# EAGLE schematic ESP32 Relay Mainboard (EAGLE 9.3.0)

## Sheet 1 of 4
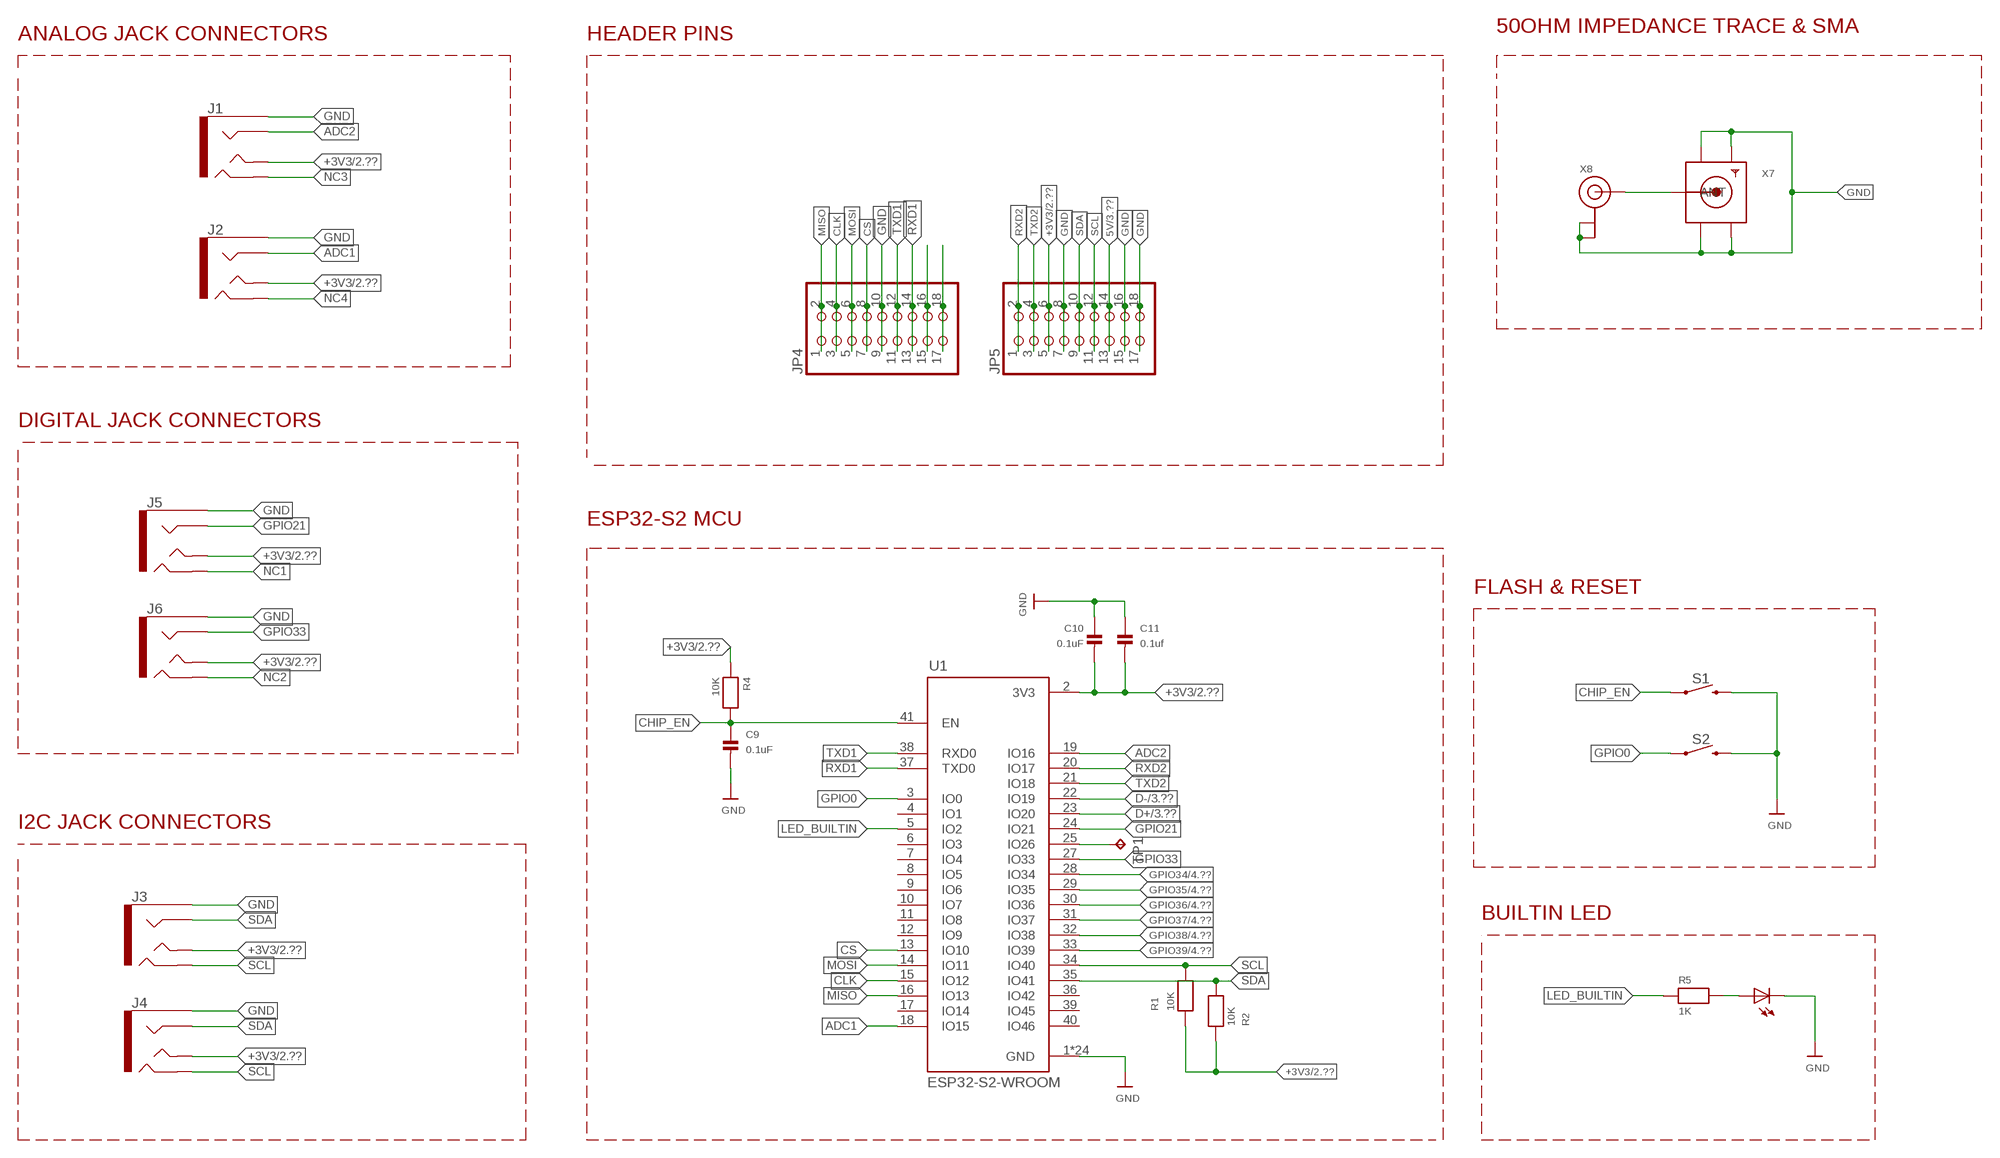
[diagram p0: schematic, sheet 1]

### Parts
C9  0.1uF  CAP_CERAMIC0805  [0805]
C10  0.1uF  CAP_CERAMIC0805  [0805]
C11  0.1uf  CAP_CERAMIC0805  [0805]
J1  AUDIO_JACK_TRRSSMD_RA  [AUDIO_JACK_3.5MM_TRRS_SMD_RA]
J2  AUDIO_JACK_TRRSSMD_RA  [AUDIO_JACK_3.5MM_TRRS_SMD_RA]
J3  AUDIO_JACK_TRRSSMD_RA  [AUDIO_JACK_3.5MM_TRRS_SMD_RA]
J4  AUDIO_JACK_TRRSSMD_RA  [AUDIO_JACK_3.5MM_TRRS_SMD_RA]
J5  AUDIO_JACK_TRRSSMD_RA  [AUDIO_JACK_3.5MM_TRRS_SMD_RA]
J6  AUDIO_JACK_TRRSSMD_RA  [AUDIO_JACK_3.5MM_TRRS_SMD_RA]
JP4  PINHD-2X9-BIG  [2X09-BIG]
JP5  PINHD-2X9-BIG  [2X09-BIG]
LED1  LEDCHIPLED_0805  [CHIPLED_0805]
R1  10K  RESISTOR0805  [0805]
R2  10K  RESISTOR0805  [0805]
R4  10K  RESISTOR0805  [0805]
R5  1K  RESISTOR0805  [0805]
S1  MOMENTARY-SWITCH-SPST-SMD-5.2-REDUNDANT  [TACTILE_SWITCH_SMD_5.2MM]
S2  MOMENTARY-SWITCH-SPST-SMD-5.2-REDUNDANT  [TACTILE_SWITCH_SMD_5.2MM]
TP1  TPTP20R  [TP20R]
U1  ESP32-S2-WROOM  [XCVR_ESP32-S2-WROOM]
X7  SMACONNECTOR_EDGE  [SMA_EDGELAUNCH]
X8  ANTENNA_U.FL  [U.FL]

### Nets
5V: JP5.13 JP5.14 ; also sheet 2,3,4
+3V3: C10.2 C11.2 J1.TIP J2.TIP J3.TIP J4.TIP J5.TIP J6.TIP JP5.5 JP5.6 R1.1 R2.1 R4.1 U1.2(3V3) ; also sheet 2
ADC1: J2.RING1 U1.18(IO15)
ADC2: J1.RING1 U1.19(IO16)
CHIP_EN: C9.1 R4.2 S1.1 S1.2 U1.41(EN)
CLK: JP4.3 JP4.4 U1.15(IO12)
CS: JP4.7 JP4.8 U1.13(IO10)
D+: U1.23(IO20) ; also sheet 3
D-: U1.22(IO19) ; also sheet 3
GND: C9.2 C10.1 C11.1 J1.EARTH J2.EARTH J3.EARTH J4.EARTH J5.EARTH J6.EARTH JP4.9 JP4.10 JP5.7 JP5.8 JP5.15 JP5.16 JP5.17 JP5.18 LED1.C S1.3 S1.4 S2.3 S2.4 U1.1(GND) U1.26(GND) U1.42(GND) U1.43.1(GND) U1.43.2(GND) U1.43.3(GND) U1.43.4(GND) U1.43.5(GND) U1.43.6(GND) U1.43.7(GND) U1.43.8(GND) U1.43.9(GND) U1.43.10(GND) U1.43.11(GND) U1.43.12(GND) U1.43.13(GND) U1.43.14(GND) U1.43.15(GND) U1.43.16(GND) U1.43.17(GND) U1.43.18(GND) U1.43.19(GND) U1.43.20(GND) U1.43.21(GND) X7.GND@1(GND4) X7.GND@2(GND3) X7.GND@3(GND2) X7.GND@4(GND1) X8.1(GND) X8.2(GND) ; also sheet 2,3,4
GPIO0: S2.1 S2.2 U1.3(IO0)
GPIO21: J5.RING1 U1.24(IO21)
GPIO33: J6.RING1 U1.27(IO33)
GPIO34: U1.28(IO34) ; also sheet 4
GPIO35: U1.29(IO35) ; also sheet 4
GPIO36: U1.30(IO36) ; also sheet 4
GPIO37: U1.31(IO37) ; also sheet 4
GPIO38: U1.32(IO38) ; also sheet 4
GPIO39: U1.33(IO39) ; also sheet 4
LED_BUILTIN: R5.1 U1.5(IO2)
MISO: JP4.1 JP4.2 U1.16(IO13)
MOSI: JP4.5 JP4.6 U1.14(IO11)
N$6: LED1.A R5.2
N$8: X7.P(ANT) X8.3(SIGNAL)
N$17: TP1.TP U1.25(IO26)
N$169: JP4.15 JP4.16
N$171: JP4.17 JP4.18
NC1: J5.RING2
NC2: J6.RING2
NC3: J1.RING2
NC4: J2.RING2
RXD1: JP4.13 JP4.14 U1.37(TXD0)
RXD2: JP5.1 JP5.2 U1.20(IO17)
SCL: J3.RING2 J4.RING2 JP5.11 JP5.12 R1.2 U1.34(IO40)
SDA: J3.RING1 J4.RING1 JP5.9 JP5.10 R2.2 U1.35(IO41)
TXD1: JP4.11 JP4.12 U1.38(RXD0)
TXD2: JP5.3 JP5.4 U1.21(IO18)
Unconnected: U1.4(IO1) U1.6(IO3) U1.7(IO4) U1.8(IO5) U1.9(IO6) U1.10(IO7) U1.11(IO8) U1.12(IO9) U1.17(IO14) U1.36(IO42) U1.39(IO45) U1.40(IO46)

### Notes on the sheet
- 50OHM IMPEDANCE TRACE & SMA
- ANALOG JACK CONNECTORS | HEADER PINS
- DIGITAL JACK CONNECTORS
- ESP32-S2 MCU
- FLASH & RESET
- I2C JACK CONNECTORS
- BUILTIN LED

## Sheet 2 of 4
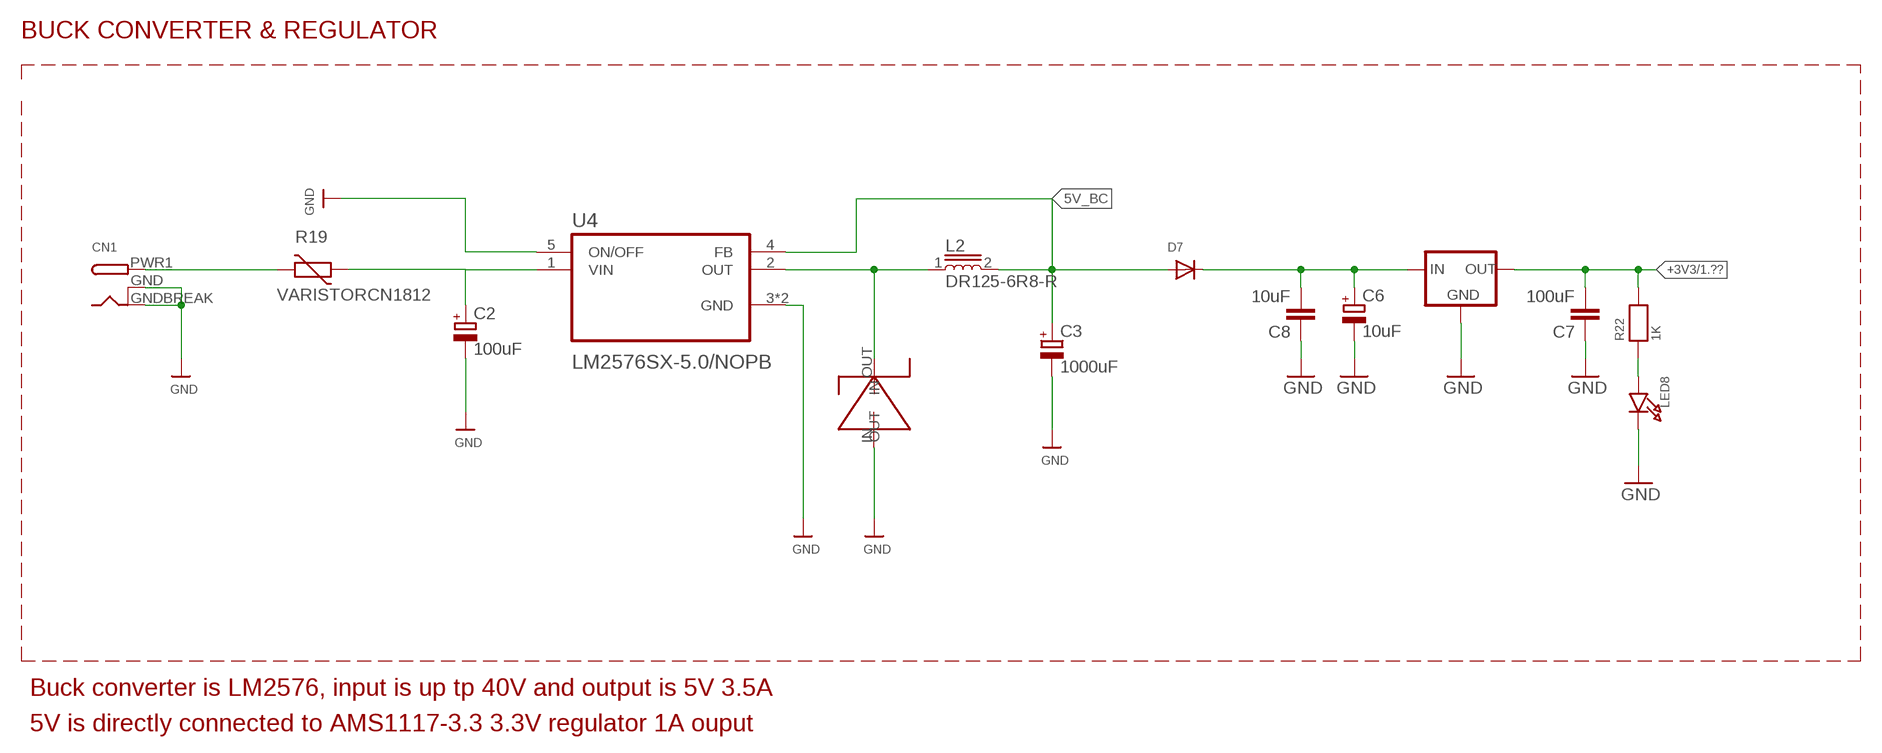
[diagram p1: schematic, sheet 2]

### Parts
3.3V  LM1117  [SOT223]
C2  100uF  CPOL-EUUD-8X10  [UD-8X10_NICHICON]
C3  1000uF  CPOL-EUUD-10X10  [UD-10X10_NICHICON]
C6  10uF  CPOL-EUUD-5X5,8  [UD-5X5,8_NICHICON]
C7  100uF  22UF-0805-6.3V-20%  [0805]
C8  10uF  22UF-0805-6.3V-20%  [0805]
CN1  DCBARRELSMT  [DCJACK_2MM_SMT]
D7  DIODESMA  [SMADIODE]
L2  DR125-6R8-R  [INDM1250X1250X600]
LED8  LED0805  [CHIPLED_0805]
R19  VARISTORCN1812  [CT/CN1812]
R22  1K  RESISTOR0805  [0805]
U4  LM2576SX-5.0/NOPB  [VREG_TPS79625KTTR]
U$8  DO-214AB  [DO-214AB]

### Nets
5V: 3.3V.3(IN) C6.+ C8.2 D7.C ; also sheet 1,3,4
5V_BC: C3.+ D7.A L2.2 U4.4(FB)
+3V3: 3.3V.2(OUT) C7.2 R22.2 ; also sheet 1
GND: 3.3V.1(GND) C2.- C3.- C6.- C7.1 C8.1 CN1.GND(GNDBREAK) CN1.GNDBREAK(GND) LED8.C U4.3(GND) U4.5(ON/OFF) U4.6(GND) U$8.IN ; also sheet 1,3,4
N$1: C2.+ R19.1 U4.1(VIN)
N$5: L2.1 U4.2(OUT) U$8.OUT
N$54: CN1.PWR1(PWR) R19.2
N$71: LED8.A R22.1

### Notes on the sheet
- BUCK CONVERTER & REGULATOR
- Buck converter is LM2576, input is up tp 40V and output is 5V 3.5A
- 5V is directly connected to AMS1117-3.3 3.3V regulator 1A ouput

## Sheet 3 of 4
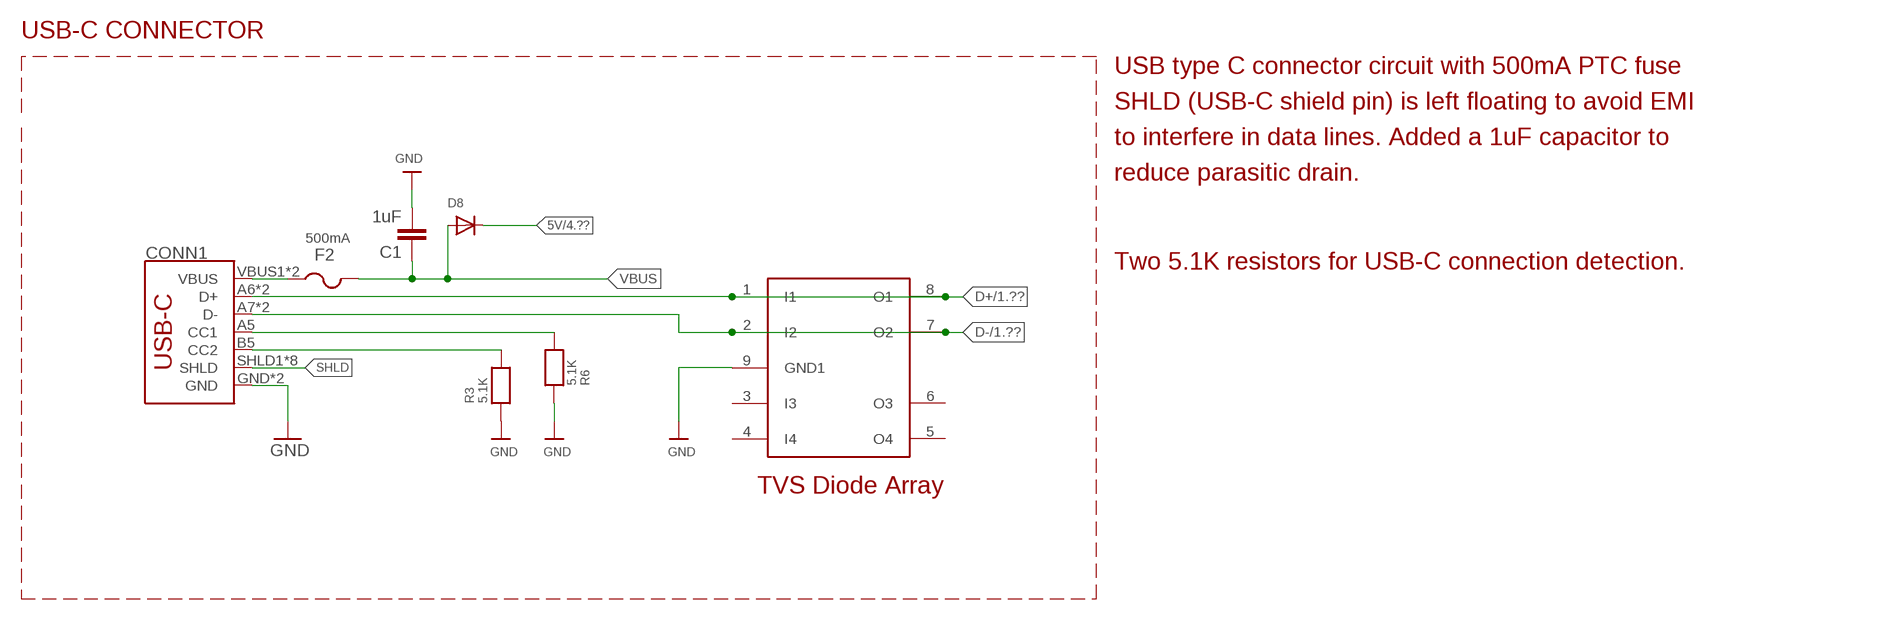
[diagram p2: schematic, sheet 3]

### Parts
C1  1uF  22UF-0805-6.3V-20%  [0805]
CONN1  USB_C16PIN  [USB-C-16P]
D8  DIODESOD-123  [SOD-123]
F2  PTCFUSE-1206  [R1206]
R3  5.1K  RESISTOR0603  [0603]
R6  5.1K  RESISTOR0603  [0603]
U$16  AZ1045  [RCLAMP0524JTCT]

### Nets
5V: D8.C ; also sheet 1,2,4
D+: CONN1.A6(D+) CONN1.B6(D+) U$16.1(I1) U$16.8(O1) ; also sheet 1
D-: CONN1.A7(D-) CONN1.B7(D-) U$16.2(I2) U$16.7(O2) ; also sheet 1
GND: C1.2 CONN1.GND CONN1.GND2(GND) R3.1 R6.1 U$16.9(GND1) ; also sheet 1,2,4
N$10: CONN1.A5(CC1) R6.2
N$13: CONN1.B5(CC2) R3.2
SHLD: CONN1.SHLD1(SHLD) CONN1.SHLD2(SHLD) CONN1.SHLD3(SHLD) CONN1.SHLD4(SHLD) CONN1.SHLD5(SHLD) CONN1.SHLD6(SHLD) CONN1.SHLD7(SHLD) CONN1.SHLD8(SHLD)
VBUS: C1.1 D8.A F2.2
X_VBUS: CONN1.VBUS1(VBUS) CONN1.VBUS2(VBUS) F2.1
Unconnected: U$16.3(I3) U$16.4(I4) U$16.5(O4) U$16.6(O3)

### Notes on the sheet
- USB-C CONNECTOR
- USB type C connector circuit with 500mA PTC fuse
- SHLD (USB-C shield pin) is left floating to avoid EMI
- to interfere in data lines. Added a 1uF capacitor to
- reduce parasitic drain.
- 500mA
- Two 5.1K resistors for USB-C connection detection.
- TVS Diode Array

## Sheet 4 of 4
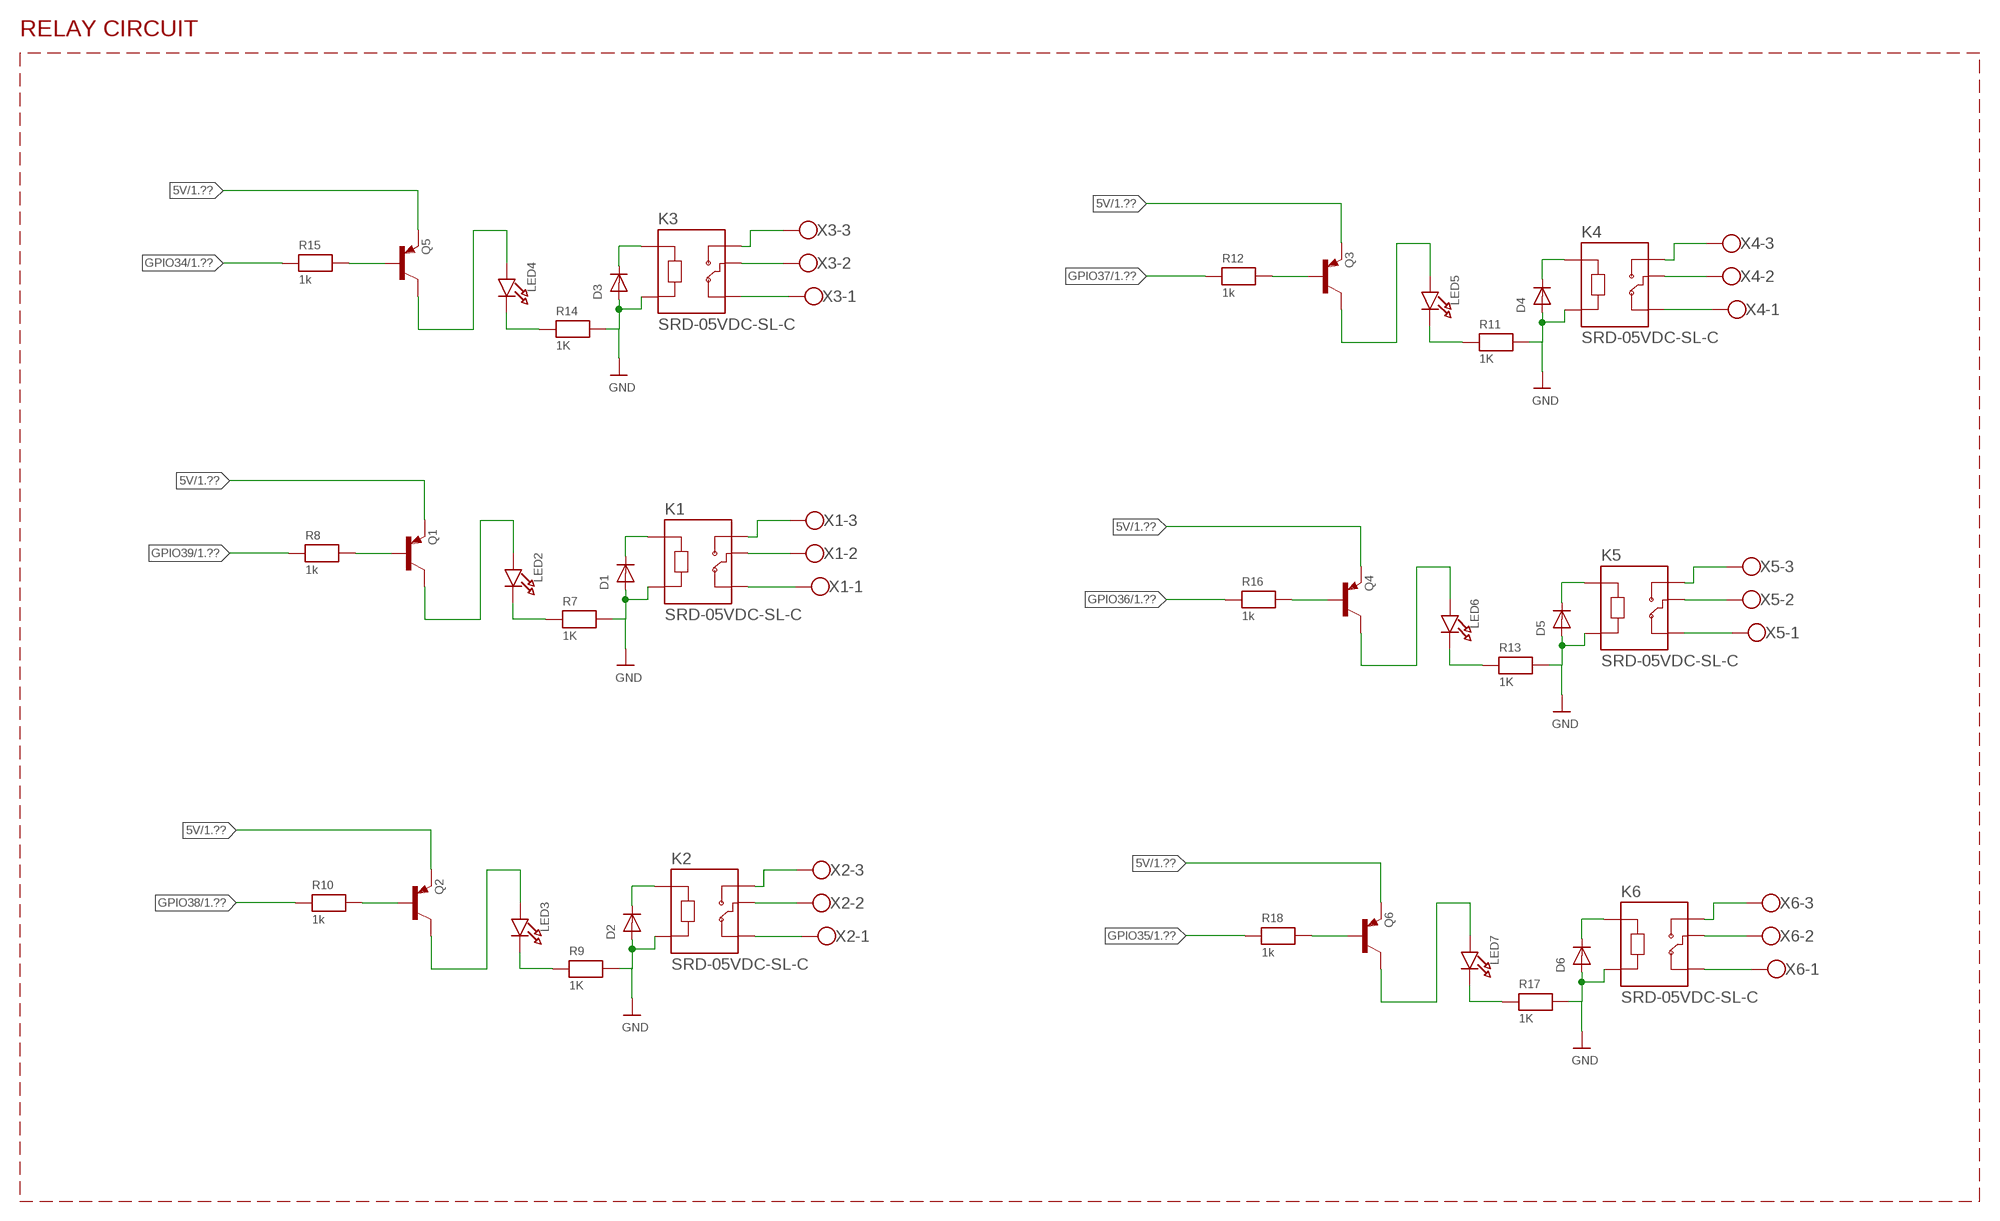
[diagram p3: schematic, sheet 4]

### Parts
D1  DIODESMA  [SMADIODE]
D2  DIODESMA  [SMADIODE]
D3  DIODESMA  [SMADIODE]
D4  DIODESMA  [SMADIODE]
D5  DIODESMA  [SMADIODE]
D6  DIODESMA  [SMADIODE]
K1  SRD-05VDC-SL-C  [RELAY_SRD-05VDC-SL-C]
K2  SRD-05VDC-SL-C  [RELAY_SRD-05VDC-SL-C]
K3  SRD-05VDC-SL-C  [RELAY_SRD-05VDC-SL-C]
K4  SRD-05VDC-SL-C  [RELAY_SRD-05VDC-SL-C]
K5  SRD-05VDC-SL-C  [RELAY_SRD-05VDC-SL-C]
K6  SRD-05VDC-SL-C  [RELAY_SRD-05VDC-SL-C]
LED2  LED0805  [CHIPLED_0805]
LED3  LED0805  [CHIPLED_0805]
LED4  LED0805  [CHIPLED_0805]
LED5  LED0805  [CHIPLED_0805]
LED6  LED0805  [CHIPLED_0805]
LED7  LED0805  [CHIPLED_0805]
Q1  -PNP-SOT23-BCE  [SOT23-BCE]
Q2  -PNP-SOT23-BCE  [SOT23-BCE]
Q3  -PNP-SOT23-BCE  [SOT23-BCE]
Q4  -PNP-SOT23-BCE  [SOT23-BCE]
Q5  -PNP-SOT23-BCE  [SOT23-BCE]
Q6  -PNP-SOT23-BCE  [SOT23-BCE]
R7  1K  RESISTOR0805  [0805]
R8  1k  RESISTOR0805  [0805]
R9  1K  RESISTOR0805  [0805]
R10  1k  RESISTOR0805  [0805]
R11  1K  RESISTOR0805  [0805]
R12  1k  RESISTOR0805  [0805]
R13  1K  RESISTOR0805  [0805]
R14  1K  RESISTOR0805  [0805]
R15  1k  RESISTOR0805  [0805]
R16  1k  RESISTOR0805  [0805]
R17  1K  RESISTOR0805  [0805]
R18  1k  RESISTOR0805  [0805]
X1  W237-103  [W237-103]
X2  W237-103  [W237-103]
X3  W237-103  [W237-103]
X4  W237-103  [W237-103]
X5  W237-103  [W237-103]
X6  W237-103  [W237-103]

### Nets
5V: Q1.E Q2.E Q3.E Q4.E Q5.E Q6.E ; also sheet 1,2,3
GND: D1.A D2.A D3.A D4.A D5.A D6.A K1.A2 K2.A2 K3.A2 K4.A2 K5.A2 K6.A2 R7.2 R9.2 R11.2 R13.2 R14.2 R17.2 ; also sheet 1,2,3
GPIO34: R15.1 ; also sheet 1
GPIO35: R18.1 ; also sheet 1
GPIO36: R16.1 ; also sheet 1
GPIO37: R12.1 ; also sheet 1
GPIO38: R10.1 ; also sheet 1
GPIO39: R8.1 ; also sheet 1
N$9: K1.NO X1.3
N$11: D1.C K1.A1
N$12: LED2.C R7.1
N$14: Q1.B R8.2
N$15: LED2.A Q1.C
N$16: K1.COM X1.2
N$18: K1.NC X1.1
N$19: K2.NO X2.3
N$20: D2.C K2.A1
N$21: LED3.C R9.1
N$22: Q2.B R10.2
N$23: LED3.A Q2.C
N$24: K2.COM X2.2
N$25: K2.NC X2.1
N$26: K4.NO X4.3
N$27: D3.C K3.A1
N$28: D4.C K4.A1
N$29: LED5.C R11.1
N$30: Q3.B R12.2
N$31: LED4.C R14.1
N$32: Q5.B R15.2
N$33: LED4.A Q5.C
N$34: K3.COM X3.2
N$35: LED5.A Q3.C
N$36: K3.NC X3.1
N$37: K4.COM X4.2
N$38: K3.NO X3.3
N$39: K4.NC X4.1
N$40: K5.NO X5.3
N$41: D5.C K5.A1
N$42: LED6.C R13.1
N$43: Q4.B R16.2
N$44: LED6.A Q4.C
N$45: K5.COM X5.2
N$46: K5.NC X5.1
N$47: K6.NO X6.3
N$48: D6.C K6.A1
N$49: LED7.C R17.1
N$50: Q6.B R18.2
N$51: LED7.A Q6.C
N$52: K6.COM X6.2
N$53: K6.NC X6.1

### Notes on the sheet
- RELAY CIRCUIT

## Library data of the parts
3.3V = v-reg-2:LM1117
C1 C7 C8 = SparkFun-Capacitors:22UF: 22µF ceramic capacitors A capacitor is a passive two-terminal electrical component used to store electrical energy temporarily in an electric field.; PROD_ID: CAP-08402; VALUE: 22uF
C2 C3 C6 = rcl:CPOL-EU: POLARIZED CAPACITOR, European symbol; SPICEPREFIX: C
C9-C11 = microbuilder:CAP_CERAMIC: Ceramic Capacitors 0402 - 0402 Surface Mount Capacitors 16pF 50V 5% [Digikey: 445-4899-2-ND] 18pF 50V 5% [Digikey: 490-1281-2-ND] 22pF 50V 5% [Digikey: 490-1283-2-ND] 68pF 50V 5% [Digikey: 490-1289-2-ND] 0.1uF 10V 10% [Digikey: 490-1318-2-ND] 1.0uF 6.3V 10% [Digikey: 490-1320-2-ND] 0603 - 0603 Surface Mount Capacitors 16 pF 50V 5% [Digikey: 445-5051-2-ND] 22 pF 50V [Digikey: PCC220ACVTR-ND] 33 pF 50V 5% [Digikey: 490-1415-1-ND] 56pF 50V 5% [Digikey: 490-1421-1-ND] 220pF 50V 5% [Digikey: 445-1285-1-ND] 680 pF 50V 2200 pF 50V 5% C0G [Digikey: 445-1297-1-ND] 5600 pF 100V 5% X7R [Digikey: 478-3711-1-ND] 0.1 µF 25V 10% [Digikey: PCC2277TR-ND] 0.22 µF 16V 10% X7R [Digikey: 445-1318-1-ND] 1.0 µF 25V 10% [Digikey: 445-5146-2-ND] 0603 - RF Specific 3pF 250V +/-0.1pF RF [Digikey: 712-1347-1-ND] 18 pF 250V 5% [Digikey: 478-3505-1-ND or 712-1322-1-ND] 56 pF 250V 5% C0G RF [Digikey: 490-4867-1-ND] 68 pF 250V RF [Digikey: 490-4868-1-ND] 0805 - 0805 Surface Mount Capacitors 220 pF 250V 2% RF Ceramic Capacitor [Digikey: 712-1398-1-ND] 1000 pF 50V 2% NP0 Ceramic Capacitor [Digikey: 478-3760-1-ND] 0.1 µF 25V 10% Ceramic Capacitor [Digikey: PCC1828TR-ND] 1.0 µF 16V 10% Ceramic Capacitor[Digikey: 490-1691-2-ND] 10.0 µF 10V 10% Ceramic Capacitor[Digikey: 709-1228-1-ND] 10.0 uF 16V 10% Ceramic Capacitor [Digikey: 478-5165-2-ND] 47 uF 6.3V 20% Ceramic Capacitor [Digikey: 587-1779-1-ND or 399-5506-1-ND] 1206 - 1206 Surface Mount Capacitors 47uF 10V 20% Ceramic Capacitor [Digikey: 490-5528-1-ND or 399-5508-1-ND or 445-6010-1-ND] 100uF 6.3V -20%, +80% Y5V Ceramic Capacitor (Digikey: 490-4512-1-ND, Mouser: 81-GRM31CF50J107ZE1L)
CN1 = adafruit:DCBARREL: 2.0mm DC Barrel Jack DCJACK_2MM_PTH - Through Hole Jack (4UConnector: 05537)
CONN1 = SparkFun-Connectors:USB_C: USB Type C 16Pin Connector Super Speed pins not available on the 16-pin purely SMD connector so this part is best for USB 2.0 implementations. D1 and D2 are tied together enabling D+/- no matter which way the cable is plugged into the connector. The two channel configuration pins (CC1/2) are exposed. These are normally connected to ground via 5.1k resistors but can be reconfigured for high current/high power applications.; PROD_ID: CONN-14122
D1-D8 = adafruit:DIODE: Diode SMADIODE - SMA Surface Mount Package 20V 1A Schottky Diode Digikey: 641-1014-6-ND DO-1N4148 - Through Hole Small Current Diode SOD-123 20V 1 A (.5mV Vf) Schottky Diode - Digikey: MBRX120TPMSCT-ND SOD-323 10V 570mA (.38mV Vf, 3ns) Schottky Diode - Digikey: ZLLS410CT-ND SOD-523 30V 30mA Schottky Diode (RB751S-40TE61) - Digikey: RB751S-40TE61CT-ND SOT23-R/W - SOT23 Package (R = Solder Paste/Reflow Ovens, W = Hand-Soldering) BAT54Film 40V 300mA - Digikey: 497-7162-1-ND
F2 = adafruit:PTCFUSE: PTC fuses, resettable thermistors
J1-J6 = SparkFun-Connectors:AUDIO_JACK_TRRS: Audio Jack - 3.5mm TRRS (SMD) This is a 3.5mm TRRS SMD audio jack. TRRS connectors are the audio-style connectors that you see on some phones, MP3 players and development boards. TRRS stands for “tip, ring, ring, sleeve,” which reflects that this has three conductors and a ground. SparkFun Products: Audio Jack <https://www.sparkfun.com/products/12639> mbed Starter Kit <https://www.sparkfun.com/products/12968> SparkFun TRRS 3.5mm Jack Breakout <https://www.sparkfun.com/products/11570>; PROD_ID: CONN-10676; SF_ID: PRT-12639
JP4 JP5 = adafruit:PINHD-2X9: PIN HEADER With larger annulars
K1-K6 = SRD-05VDC-SL-C:SRD-05VDC-SL-C: 5V Trigger Relay Module For Arduino And Raspberry Pi 5V Trigger Relay Module For Arduino And Raspberry Pi; AVAILABILITY: Unavailable; DESCRIPTION: 5V Trigger Relay Module For Arduino And Raspberry Pi 5V Trigger Relay Module For Arduino And Raspberry Pi; MF: Songle Relay; MP: SRD-05VDC-SL-C; PACKAGE: None; PRICE: None
L2 = DR125-6R8-R:DR125-6R8-R: Inductor Power Shielded Drum Core 3.084u(OCL)H/3.3uH 20% 100KHz Ferrite 9.26A 6.3mOhm DCR T/R Check prices <https://snapeda.com/parts/DR125-6R8-R/Eaton/view-part/?ref=eda>; ARROW_ELECTRONICS-PURCHASE-URL: https://snapeda.com/shop?store=Arrow+Electronics&id=1760770; AVAILABILITY: Good; DESCRIPTION: 6.8µH Shielded Wirewound Inductor 6.64A 12.3mOhm Nonstandard; MF: Eaton; MOUSER-PURCHASE-URL: https://snapeda.com/shop?store=Mouser&id=1760770; MP: DR125-6R8-R; PACKAGE: Nonstandard Eaton; PRICE: None
LED1 = adafruit:LED: LED
LED2-LED8 = microbuilder:LED: LED
Q1-Q6 = transistor-neu-to92:*-PNP-: PNP Transistror
R1-R18 R22 = microbuilder:RESISTOR: Resistors 0402 - 0402 Surface Mount Package 22 Ohm 1% 1/16W [Digikey: 311-22.0LRTR-ND] 33 Ohm 5% 1/16W 1.0K 5% 1/16W 1.5K 5% 1/16W 2.0K 1% 1/16W 10.0K 1% 1/16W [Digikey: 311-10.0KLRTR-ND] 10.0K 5% 1/16W [Digikey: RMCF0402JT10K0TR-ND] 12.1K 1% 1/16W [Digikey: 311-22.0LRTR-ND] 100.0K 5% 1/16W 0603 - 0603 Surface Mount Package 0 Ohm 1/10 Watt 1% Resistor 15 Ohm 1/10 Watt 1% Resistor 33 Ohm 1/10 Watt 1% Resistor 49.9 Ohm 1/10 Watt 1% Resistor 100 Ohm 1/10 Watt 1% Resistor 150 Ohm 1/10 Watt 1% Resistor 240 Ohm 1/10 Watt 1% Resistor 390 Ohm 1/10 Watt 1% Resistor 560 Ohm 1/10 Watt 1% Resistor 680 Ohm 1/10 Watt 1% Resistor 750 Ohm 1/10 Watt 1% Resistor 1.0K Ohm 1/10 Watt 1% Resistor 1.5K Ohm 1/10 Watt 1% Resistor 2.0K Ohm 1/10 Watt 1% Resistor 2.2K Ohm 1/10 Watt 1% Resistor 3.3K Ohm 1/10 Watt 1% Resistor 4.7K Ohm 1/10 Watt 1% Resistor 10.0K Ohm 1/10 Watt 1% Resistor 12.0K Ohm 1/10 Watt 1% Resistor 12.1K Ohm 1/10 Watt 1% Resistor 20.0K Ohm 1/10 Watt 1% Resistor 33.0K Ohm 1/10 Watt 1% Resistor 100.0K Ohm 1/10 Watt 1% Resistor 0805 - 0805 Surface Mount Package 0 Ohm 1/8 Watt 1% Resistor 33 Ohm 1/8 Watt 1% Resistor 100 Ohm 1/8 Watt 1% Resistor 150 Ohm 1/8 Watt 1% Resistor 200 Ohm 1/8 Watt 1% Resistor 240 Ohm 1/8 Watt 1% Resistor 330 Ohm 1/8 Watt 1% Resistor 390 Ohm 1/8 Watt 1% Resistor 470 Ohm 1/8 Watt 1% Resistor 1.0K Ohm 1/8 Watt 1% Resistor 1.5K Ohm 1/8 Watt 1% Resistor 2.0K Ohm 1/8 Watt 1% Resistor 4.7K Ohm 1/8 Watt 1% Resistor 5.1K Ohm 1/8 Watt 1% Resistor 5.6K Ohm 1/8 Watt 1% Resistor 10.0K Ohm 1/8 Watt 1% Resistor 22.0K Ohm 1/8 Watt 1% Resistor 33.0K Ohm 1/8 Watt 1% Resistor 100K Ohm 1/8 Watt 1% Resistor 1206 - 1206 Surface Mount Package 2012 - 2010 Surface Mount Package 0.11 Ohm 1/2 Watt 1% Resistor - Digikey: RHM.11UCT-ND
R19 = varistor:VARISTOR: VARISTOR
S1 S2 = SparkFun-Switches:MOMENTARY-SWITCH-SPST: Momentary Switch (Pushbutton) - SPST Normally-open (NO) SPST momentary switches (buttons, pushbuttons). Variants PTH-12MM - 12mm square, through-hole Momentary Pushbutton Switch - 12mm Square <https://www.sparkfun.com/products/9190> (COM-09190) PTH-6.0MM, PTH-6.0MM-KIT - 6.0mm square, through-hole Mini Pushbutton Switch <https://www.sparkfun.com/products/97> (COM-00097) KIT package intended for soldering kit's - only one side of pads' copper is exposed. PTH-RIGHT-ANGLE-KIT - Right-angle, through-hole Right Angle Tactile Button <https://www.sparkfun.com/products/10791> - Used on SparkFun BigTime Watch Kit <https://www.sparkfun.com/products/11734> SMD-12MM - 12mm square, surface-mount Tactile Button - SMD (12mm) <https://www.sparkfun.com/products/12993> (COM-12993) Used on SparkFun PicoBoard <https://www.sparkfun.com/products/11888> SMD-4.5MM - 4.5mm Square Trackball Switch Used on SparkFun Blackberry Trackballer Breakout <https://www.sparkfun.com/products/13169> SMD-4.6MMX2.8MM - 4.60mm x 2.80mm, surface mount Used on SparkFun SAMD21 Mini Breakout <https://www.sparkfun.com/products/13664> SMD-5.2MM, SMD-5.2-REDUNDANT - 5.2mm square, surface-mount Mini Pushbutton Switch - SMD <https://www.sparkfun.com/products/8720> (COM-08720) Used on Arduino Pro Mini <https://www.sparkfun.com/products/11114> REDUNDANT package connects both switch circuits together SMD-6.0X3.5MM - 6.0 x 3.5mm, surface mount Momentary Reset Switch SMD <https://www.sparkfun.com/products/8229> (COM-08229) SMD-6.2MM-TALL - 6.2mm square, surface mount Tactile Button - SMD (6mm) <https://www.sparkfun.com/products/12992> Used on SparkFun Digital Sandbox <https://www.sparkfun.com/products/12651> SMD-RIGHT-ANGLE - Right-angle, surface mount Used on SparkFun Block for Intel® Edison - Arduino <https://www.sparkfun.com/products/13036>; PROD_ID: SWCH-08247; SF_SKU: COM-08720
TP1 = testpad:TP: Test pad
U1 = ESP32-S2-WROOM:ESP32-S2-WROOM: WiFi 802.11b/g/n Transceiver Module 2.4GHz PCB Trace Surface Mount; AVAILABILITY: Unavailable; DESCRIPTION: WiFi 802.11b/g/n Transceiver Module 2.4GHz PCB Trace Surface Mount; MF: Espressif Systems; MP: ESP32-S2-WROOM; PACKAGE: VFQFN-56 Espressif Systems; PRICE: None
U4 = LM2576SX-5.0_NOPB:LM2576SX-5.0/NOPB; AVAILABILITY: Unavailable; DESCRIPTION: Buck Switching Regulator IC Positive Fixed 5V 1 Output 3A TO-263-6, D²Pak (5 Leads + Tab), TO-263BA; MF: National Semiconductor; MP: LM2576SX50; PACKAGE: TO-263-6 National Semiconductor; PRICE: None
U$8 = DO-214AB:DO-214AB; AVAILABILITY: Unavailable; DESCRIPTION: Diode Schottky 40V 4A Surface Mount SMC; MF: Littelfuse Inc.; MP: DO-214AB; PACKAGE: DO-214AB-214 Littelfuse Inc.; PRICE: None
U$16 = AZ1045:AZ1045
X1-X6 = con-wago-500:W237-103: WAGO SCREW CLAMP; MPN: 237-103; OC_FARNELL: unknown; OC_NEWARK: 18M7116
X7 = adafruit:SMACONNECTOR: SMA Connector 90° DIP SMA Connector, 50 Ohm (4UConnector: 07259)
X8 = adafruit:ANTENNA_U.FL: U.FL Antenna Connector